# EAGLE design yin_bit (EAGLE 9.2.2)
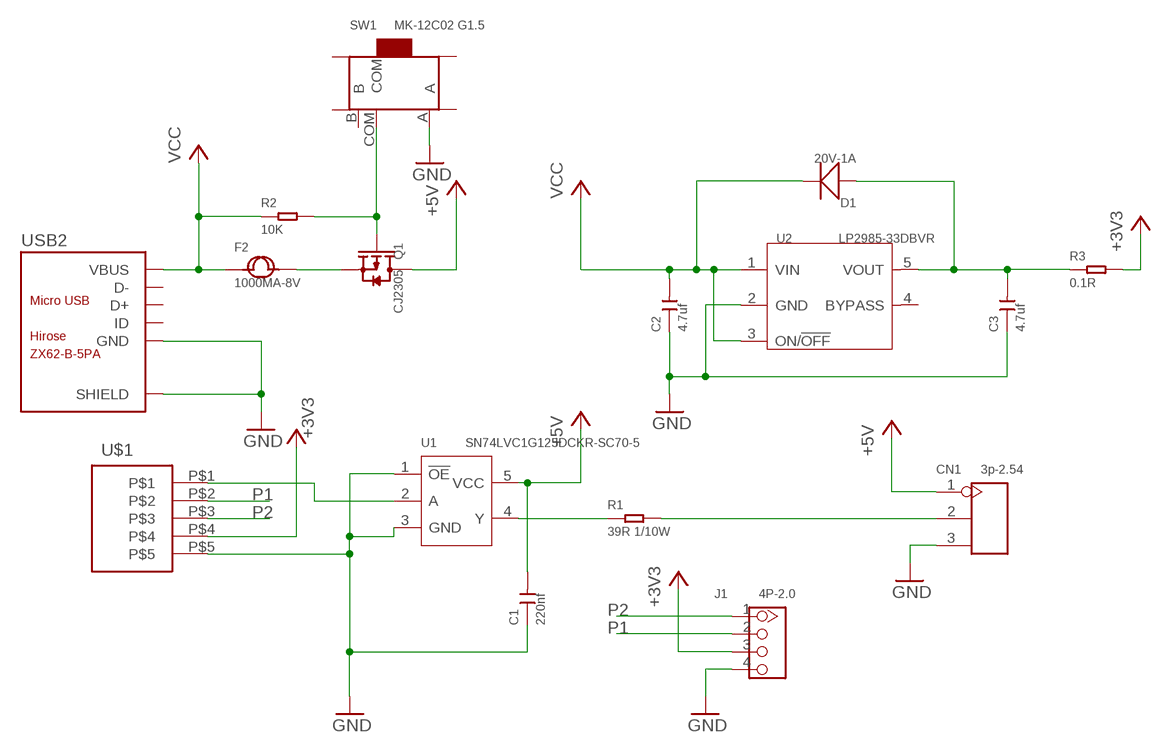
[diagram p0: schematic, sheet 1]

## Parts
C1  220nf  CERAMIC-220NF-25V-10%-X7R(0603)  [C0603]
C2  4.7uf  CERAMIC-4.7UF-10V-10%-X5R(0603)  [C0603]
C3  4.7uf  CERAMIC-4.7UF-10V-10%-X5R(0603)  [C0603]
CN1  3p-2.54  DIP-BLACK-MALE-HEADER-VERT(3P-2.54)  [H3-2.54]
D1  20V-1A  SMD-DIODE-SCHOTTKY-20V-1A(SOD-123)  [SOD-123]
F2  1000MA-8V  SMD-PPTC-1000MA-8V(1206)  [F1206]
J1  4P-2.0  GROVE-CONNECTOR-DIP(4P-2.0)  [HW4-2.0]
Q1  CJ2305  SMD-MOSFET-P-CH-8V-4.1A-CJ2305(SOT-23)  [SOT-23]
R1  39R 1/10W  SMD-RES-39R-5%-1/10W(0603)  [R0603]
R2  10K  SMD-RES-10K-1%-1/10W(0603)  [R0603]
R3  0.1R  SMD-RES-0.1R-5%-1/8W(0805)  [R0805]
SW1  MK-12C02 G1.5  SMD-TOGGLE-SWITCH-ON-ON(3+4P-6.7X2.7MM)  [SW7-SMD-L6.7X2.7X3.2MM]
U1  SN74LVC1G125DCKR-SC70-5  LOGIC-SN74LVC1G125DCKR(SC70-5)  [SC-70-5]
U2  LP2985-33DBVR  PMIC-LP2985-33DBVR(SOT23-5)  [SOT-23-5]
U$1  MICROBIT-HOLL  [MICROBIT-HOLL]
USB2  ZX62-B-5PA  MICRO-USB-SMD(ZX62-B-5PA)  [MICRO-USB5+6P-SMD-0.65-AB]

## Nets
+3V3: J1.3 R3.2 U$1.P$4
+5V: C1.2 CN1.1 Q1.3(D) U1.5(VCC)
GND: C1.1 C2.1 C3.1 CN1.3 J1.4 SW1.A U1.1(!OE!) U1.3(GND) U2.2(GND) U$1.P$5 USB2.5(GND) USB2.P1(SHIELD) USB2.P2(SHIELD) USB2.P3(SHIELD) USB2.P4(SHIELD) USB2.P5(SHIELD) USB2.P6(SHIELD)
N$1: U1.2(A) U$1.P$1
N$2: R1.1 U1.4(Y)
N$3: CN1.2 R1.2
N$4: Q1.1(G) R2.2 SW1.COM
N$5: F2.2 Q1.2(S)
N$6: C3.2 D1.+ R3.1 U2.5(VOUT)
P1: J1.2 U$1.P$2
P2: J1.1 U$1.P$3
VCC: C2.2 D1.- F2.1 R2.1 U2.1(VIN) U2.3(ON/!OFF) USB2.1(VBUS)
Unconnected: SW1.B SW1.SS1 SW1.SS2 SW1.SS3 SW1.SS4 U2.4(BYPASS) USB2.2(D-) USB2.3(D+) USB2.4(ID)

## Library data of the parts
C1 = Seeed-Capacitor:CERAMIC-220NF-25V-10%-X7R(0603): 302010073; MPN: CC0603KRX7R8BB224
C2 C3 = Seeed-Capacitor:CERAMIC-4.7UF-10V-10%-X5R(0603): 302010111; MPN: CC0603KRX5R6BB475
CN1 = Seeed-Connector:DIP-BLACK-MALE-HEADER-VERT(3P-2.54): 320020079
D1 = Seeed-Diode:SMD-DIODE-SCHOTTKY-20V-1A(SOD-123): 304020034; MPN: B5819W
F2 = Seeed-Fuse:SMD-PPTC-1000MA-8V(1206): 307010001; MPN: KT8-1000SMD1206
J1 = Seeed-OPL-Connector:GROVE-CONNECTOR-DIP(4P-2.0): 320110033
Q1 = Seeed-Transistor:SMD-MOSFET-P-CH-8V-4.1A-CJ2305(SOT-23): 305030014; MPN: CJ2305
R1 = Seeed-OPL-Resistor:SMD-RES-39R-5%-1/10W(0603): 301010138; MPN: RC0603JR-0739RL
R2 = Seeed-Resistor:SMD-RES-10K-1%-1/10W(0603): 301010299; MPN: RC0603FR-0710KL
R3 = Seeed-Resistor:SMD-RES-0.1R-5%-1/8W(0805): 301010264; MPN: RL0805JR-070R1L
SW1 = Seeed-Switch:SMD-TOGGLE-SWITCH-ON-ON(3+4P-6.7X2.7MM): 311030001; MPN: MK-12C02 G1.5
U1 = Seeed-OPL-ic:LOGIC-SN74LVC1G125DCKR(SC70-5): 310050019; MPN: SN74LVC1G125DCKR
U2 = Seeed-OPL-ic:PMIC-LP2985-33DBVR(SOT23-5): 310030033; MPN: LP2985-33DBVR
U$1 = Seeed-Connector:MICROBIT-HOLL
USB2 = Seeed-OPL-Connector:MICRO-USB-SMD(ZX62-B-5PA): 320010005; MPN: ZX62-B-5PA

## Board
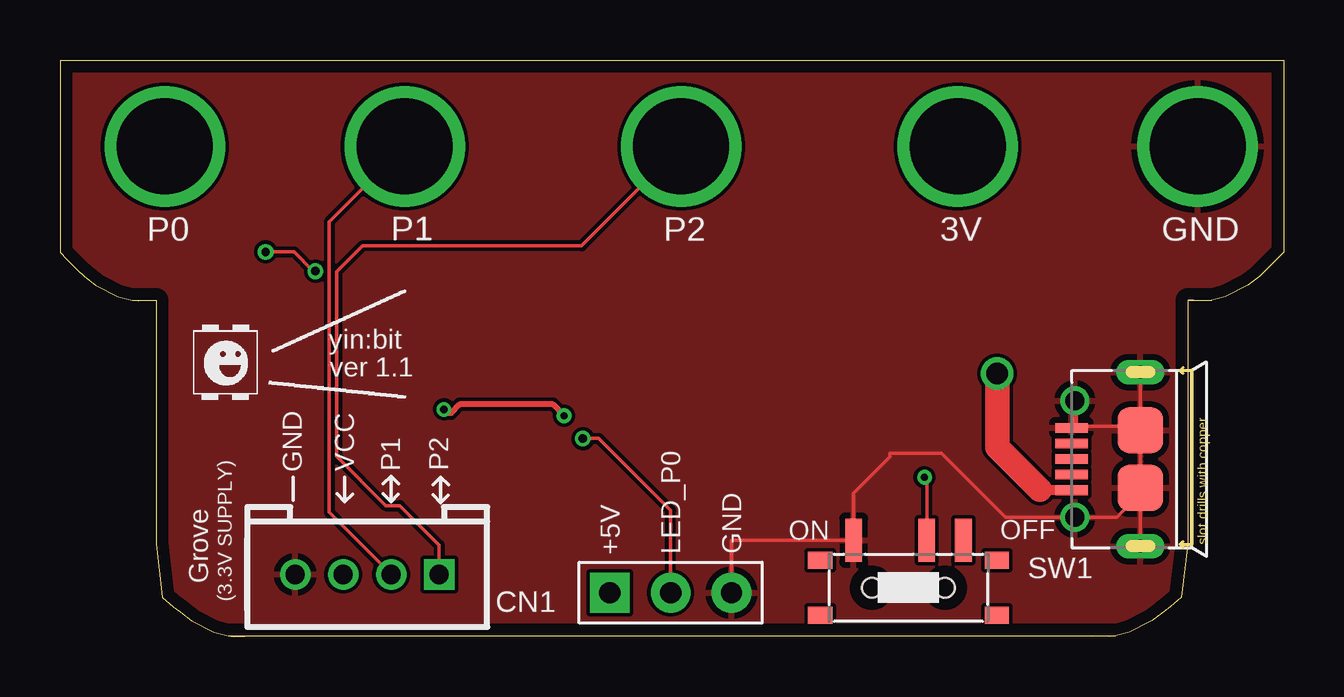
[diagram p1: board, top side]
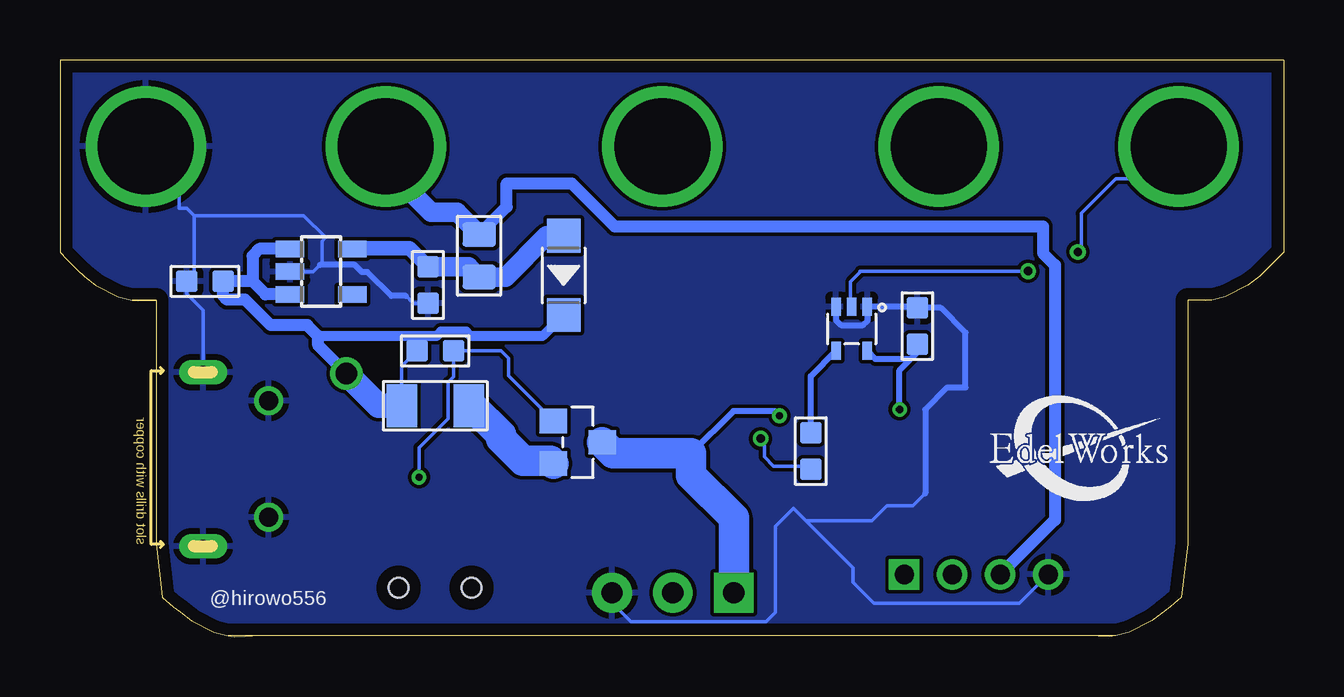
[diagram p2: board, bottom side, seen from below]

Size 51 x 24.02 mm. Coordinates in mm from the lower left corner, seen from the top.
Outline: 7,0.02 8,0.02
Outline: 43,0.02 44,0.02
Outline: 3,14.02 4,14.02
Outline: 47,14.02 48,14.02
Outline: 8,0.02 7.73,0.01 7.26,0 7,0.02
Outline: 7,0.02 6.43,0.17 5.5,0.66 5,1.02 4.72,1.24 4.26,1.63 4,3.86 4,14.02
Outline: 8,0.02 43,0.02
Outline: 47,14.02 47,3.86 46.74,1.63 46.28,1.24 46,1.02 45.5,0.66 44.57,0.17 44,0.02
Outline: 3,14.02 2.42,14.16 1.49,14.65 1,15.02 0.72,15.28 0.26,15.75 0,16.02 0,24.02 51,24.02 51,16.02 50.74,15.75 50.28,15.28 50,15.02 49.51,14.65 48.58,14.16 48,14.02
Outline: 3,14.02 3.27,14 3.73,14.01 4,14.02
Outline: 48,14.02 47.73,14 47.27,14.01 47,14.02
Outline: 44,0.02 43.74,0 43.27,0.01 43,0.02
Copper layers (1*16): Top 0.035mm / dielectric 1.6mm / Bottom 0.035mm
Design rules "Elecrow_2-layer_PCB_eagle_rule": minimum track width 6mil, minimum drill 12mil, track to track 6mil, track to pad 6mil, pad to pad 6mil, via to via 8mil, smd to smd 0mil, copper to edge 20mil, drill to drill 10mil, minimum pad ring 6mil, minimum via ring 6mil, stop-mask expansion 0mil, vias tented up to drill 100mil, thermal gap 10mil

### Footprints (pad centres in the part's own frame; a part is rotated, then mirrored left to right if it is on the bottom)
C0603 = smd 0.889 x 0.889: 1 0,0.762; 2 0,-0.762
H3-2.54 = drill 0.889 pad 1.651 square: 1 0,2.54 | drill 0.889 pad 1.651: 2 0,0; 3 0,-2.54
SOD-123 = smd 1.397 x 1.397: + -1.651,0; - 1.651,0
F1206 = smd 1.27 x 1.778: 1 -1.397,0; 2 1.397,0
HW4-2.0 = drill 0.8 pad 1.27 square: 1 -3,0 | drill 0.8 pad 1.27: 2 -1,0; 3 1,0; 4 3,0
SOT-23 = smd 1.016 x 1.143: 1 -0.889,-1.016; 2 0.889,-1.016; 3 0,1.016
R0603 = smd 0.889 x 0.889: 1 0,0.762; 2 0,-0.762
R0805 = smd 1.397 x 1.016: 1 0,0.889; 2 0,-0.889
SW7-SMD-L6.7X2.7X3.2MM = smd 1.8 x 0.7: A 1.978,2.286; B 1.978,-2.286; COM 1.978,-0.762 | smd 0.7 x 1.016: SS1 -1.15,-3.683; SS2 1.15,-3.683; SS3 1.15,3.683; SS4 -1.15,3.683 | hole 0.813: 0,-1.524; 0,1.524
SC-70-5 = smd 0.4 x 0.75: 1 -0.65,-0.925; 2 0,-0.925; 3 0.65,-0.925; 4 0.65,0.925; 5 -0.65,0.925
SOT-23-5 = smd 0.69 x 1.2: 1 -0.95,-1.3; 2 0,-1.3; 3 0.95,-1.3; 4 0.95,1.3; 5 -0.95,1.3
MICROBIT-HOLL = drill 4: P$1 -11.43,0; P$2 -1.43,0; P$3 10.094,0; P$4 21.618,0; P$5 31.618,0
MICRO-USB5+6P-SMD-0.65-AB = smd 0.4 x 1.35: 1 -1.3,2.875; 2 -0.65,2.875; 3 0,2.875; 4 0.65,2.875; 5 1.3,2.875 | smd 1.9 x 1.9: P1 -1.2,0; P2 1.2,0 | drill 0.508 pad 1.016 long: P3 -3.625,0; P4 3.625,0 | drill 0.8: P5 -2.425,2.73; P6 2.425,2.73

### Placement (x,y rotation side)
C1  15.26,12.93 0 bottom
C2  44.96,14.8 90 bottom
C3  35.66,14.65 180 bottom
CN1  25.45,1.83 90 top
D1  30,15.05 270 bottom
F2  35.36,9.62 0 bottom
J1  12.8,2.59 180 top
Q1  29.41,8.09 270 bottom
R1  19.7,7.72 0 bottom
R2  35.36,11.9 90 bottom
R3  33.53,15.87 180 bottom
SW1  35.37,2.03 90 top
U1  18,12.82 180 bottom
U2  40.11,15.21 270 bottom
U$1  15.8,20.42 0 top
USB2  45.03,7.39 90 top

### Tracks (layer width: path | path; a pad name or v marks a point on that pad's centre or on a via)
+3V3
  Bottom 0.508: R3.2 32.38,17.91 32.38,18.89 29.68,18.89 27.88,17.09 10.03,17.09 10.03,15.98 9.53,15.48 9.53,4.87 J1.3
  Bottom 0.813: U$1.P$4 37.42,19.55 35.54,17.67 34.44,17.67 R3.2
+5V  (via drill 0.3)
  Top 0.254: v21.01,9.2 20.54,9.67 16.66,9.67 16.31,9.31 16.16,9.31 v16,9.47
  Bottom 0.254: C1.2 14.94,12.17 15.55,11.56 | 15.55,11.56 17.01,11.56 U1.5 | 24.69,7.64 22.93,9.39 21.2,9.39 v21.01,9.2 | v16,9.47 16,11.11 15.55,11.56
  Bottom 1.27: Q1.3 27.94,7.64 24.69,7.64 24.69,6.72 22.91,4.94 CN1.1
GND
  Top 0.152: USB2.P2 45.03,8.55 | 45.03,8.55 USB2.P1 45.03,5.96 | 45.03,5.96 USB2.P3 | CN1.3 27.99,4.01 SW1.A 33.08,5.97 34.6,7.48 34.6,7.64 36.73,7.64 39.4,4.97 USB2.P5 44.04,4.97 45.03,5.96 | 42.3,8.76 44.82,8.76 44.92,8.67 | 44.92,8.67 45.03,8.55 | USB2.P4 45.03,8.78 44.92,8.67
  Top 0.254: USB2.P6 42.3,8.76 42.23,8.76 USB2.5
  Bottom 0.152: U$1.P$5 46.03,20.04 46.03,17.85 45.72,17.85 45.42,17.54 | U2.2 40.44,15.21 40.16,15.49 40.08,15.56 40.08,16.48 39.93,16.63 40.84,17.54 45.42,17.54 | 36.58,14.19 36.27,13.89 C3.1 | 45.42,17.54 45.42,15.1 C2.1 45.72,14.28 45.03,13.59 USB2.P4 | 19.9,4.83 17.94,2.87 17.94,2.26 17.07,1.39 11,1.39 J1.4 | 19.9,4.83 20.42,5.35 21.18,4.59 21.18,1.01 21.57,0.63 27.2,0.63 27.99,1.41 CN1.3 | 14.94,5.96 15.44,5.45 16.53,5.45 17.15,4.83 19.9,4.83
  Bottom 0.254: 17.33,13.73 U1.1 | 17.33,13.73 15.3,13.73 C1.1 14.29,13.7 13.26,12.67 13.26,10.38 14.02,10.38 14.94,9.47 14.94,5.96 | U1.3 18.65,13.18 18.44,12.97 17.53,12.97 17.33,13.17 17.33,13.73 | 36.58,14.19 37.19,14.19 38.18,15.18 38.41,15.18 38.71,15.49 40.16,15.49
  pour Top: -1.6,25.68 53.2,25.68 53.2,-2.15 -1.6,-2.15
  pour Bottom: -1.69,26.19 53.84,26.19 53.84,-2.79 -1.69,-2.79
N$1  (via drill 0.35)
  Top 0.152: v8.57,16.02 9.76,16.02 10.56,15.22 v10.65,15.22
  Bottom 0.152: U$1.P$1 5.73,19.07 7,19.07 8.43,17.63 8.43,16.17 v8.57,16.02 | v10.65,15.22 17.65,15.22 17.65,15.18 18.05,14.78 18.05,13.8 U1.2
N$2
  Bottom 0.254: R1.1 19.7,10.85 U1.4
N$3  (via drill 0.35)
  Top 0.152: CN1.2 25.45,5.26 22.46,8.26 21.8,8.26 v21.79,8.25
  Bottom 0.152: R1.2 19.84,7.1 21.26,7.1 21.64,7.48 21.64,7.94 21.72,8.02 21.72,8.17 v21.79,8.25
N$4  (via drill 0.3)
  Top 0.152: SW1.COM 36.13,6.54 v36.03,6.64
  Bottom 0.152: v36.03,6.64 36.03,7.88 34.82,9.09 34.82,10.6 34.6,10.83 R2.2 32.61,11.9 32.31,11.6 32.31,10.86 Q1.1
N$5
  Bottom 1.27: Q1.2 30.56,7.33 31.7,7.33 32.61,8.25 32.61,8.4 33.83,9.62 F2.2
N$6
  Bottom 0.61: C3.2 36.42,16.17 38.8,16.17 U2.5
  Bottom 0.813: C3.2 33.96,15.41 R3.1 32.44,14.98 30.71,16.7 D1.+
P1
  Top 0.152: U$1.P$2 11.22,17.28 11.22,5.17 J1.2
P2
  Top 0.152: U$1.P$3 21.74,16.27 12.61,16.27 11.52,15.19 11.52,7.51 13.58,5.45 14.16,5.45 15.8,3.81 J1.1
VCC  (via drill 0.9)
  Top 0.406: USB2.1 40.86,6.09 40.84,6.11
  Top 1.016: v39.07,10.96 39.07,7.89 40.84,6.11
  Bottom 0.152: R2.1 36.75,11.27 F2.1
  Bottom 0.406: D1.- 30.89,12.51 33.88,12.51 34.07,12.7 35.12,12.7 35.31,12.51 40.23,12.51
  Bottom 0.508: v39.07,10.96 40.23,12.13 40.23,12.51 40.69,12.97 42.22,12.97 43.28,14.04 44.04,14.04 44.2,14.19 C2.2 42.98,14.8 | U2.3 42.43,14.26 42.98,14.8 | U2.1 42.69,16.16 42.98,15.87 42.98,14.8
  Bottom 1.016: v39.07,10.96 37.72,9.62 F2.1

### Text on the board
tPlace: yin:bit | ver 1.1 | ON | OFF | +5V | LED_P0 | GND
tNames: P0 | P1 | P2 | 3V | GND | GND | VCC | P1 | P2 | Grove | (3.3V SUPPLY)
bNames: @hirowo556